# EAGLE design debouncer (EAGLE 9.4.2)
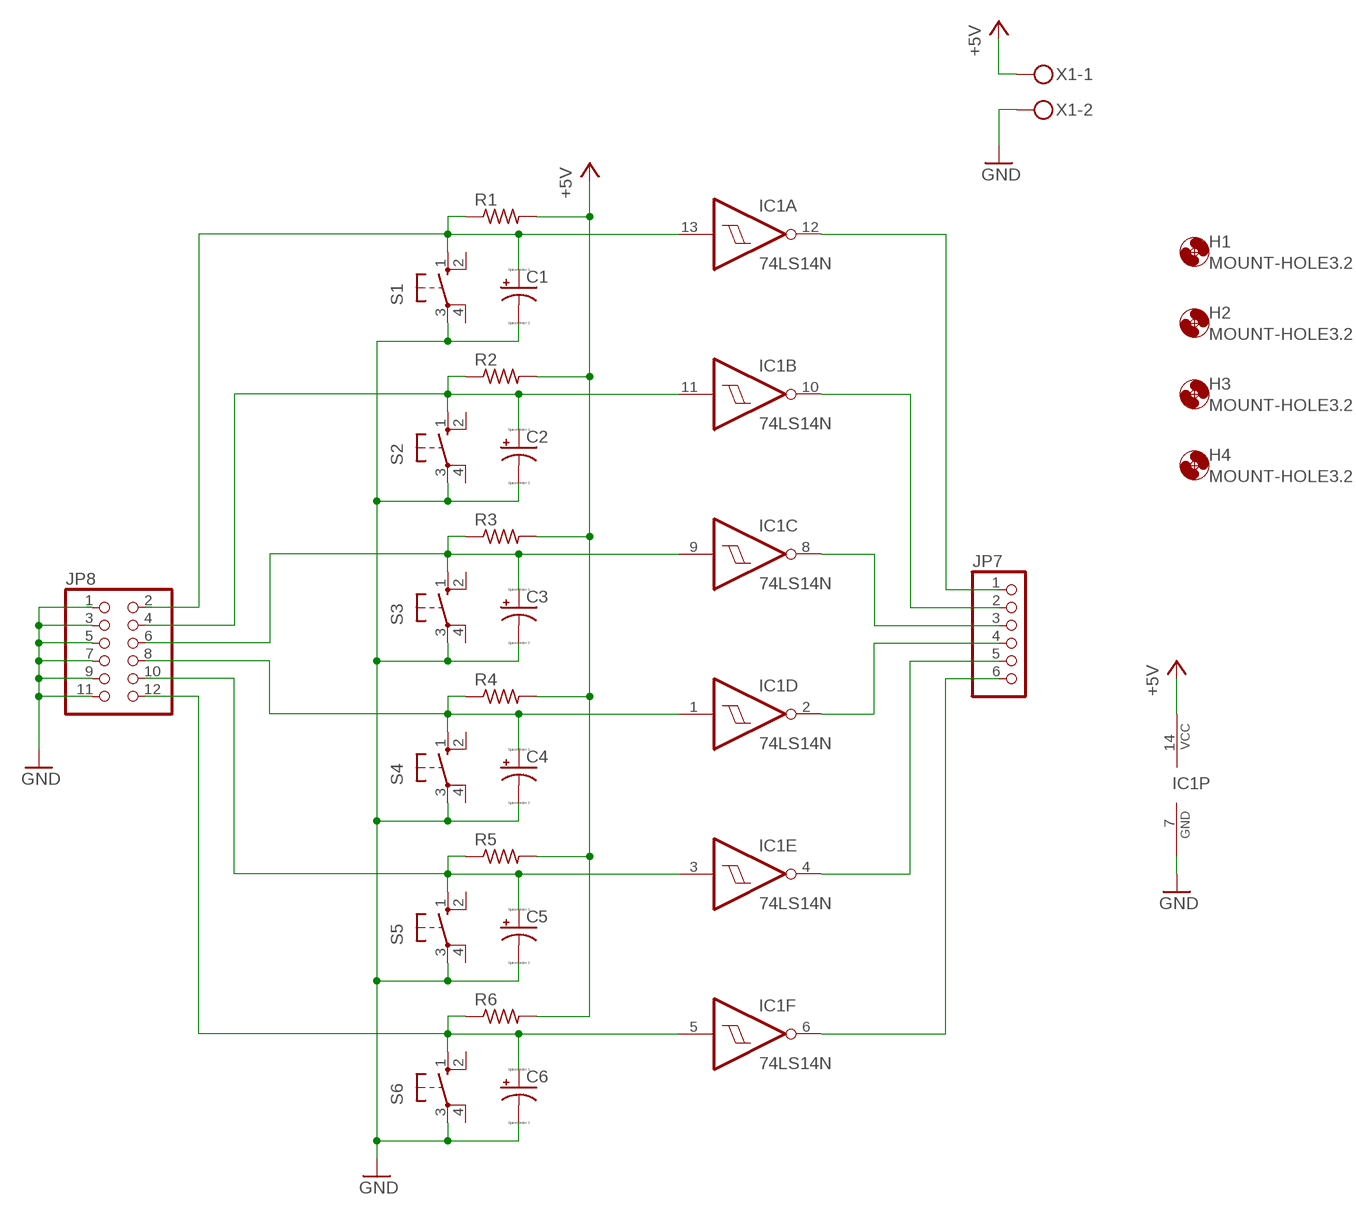
[diagram p0: schematic, sheet 1]

## Parts
C1  CPOL-USE2-5  [E2-5]
C2  CPOL-USE2-5  [E2-5]
C3  CPOL-USE2-5  [E2-5]
C4  CPOL-USE2-5  [E2-5]
C5  CPOL-USE2-5  [E2-5]
C6  CPOL-USE2-5  [E2-5]
H1  MOUNT-HOLE3.2  [3,2]
H2  MOUNT-HOLE3.2  [3,2]
H3  MOUNT-HOLE3.2  [3,2]
H4  MOUNT-HOLE3.2  [3,2]
IC1  74LS14N  [DIL14]
JP7  PINHD-1X6  [1X06]
JP8  PINHD-2X6  [2X06]
R1  R-US_0207/12  [0207/12]
R2  R-US_0207/12  [0207/12]
R3  R-US_0207/12  [0207/12]
R4  R-US_0207/12  [0207/12]
R5  R-US_0207/12  [0207/12]
R6  R-US_0207/12  [0207/12]
S1  10-XX  [B3F-10XX]
S2  10-XX  [B3F-10XX]
S3  10-XX  [B3F-10XX]
S4  10-XX  [B3F-10XX]
S5  10-XX  [B3F-10XX]
S6  10-XX  [B3F-10XX]
X1  MKDSN1,5/2-5,08  [MKDSN1,5/2-5,08]

## Nets
+5V: IC1.14(P:VCC) R1.2 R2.2 R3.2 R4.2 R5.2 R6.2 X1.1
GND: C1.- C2.- C3.- C4.- C5.- C6.- IC1.7(P:GND) JP8.1 JP8.3 JP8.5 JP8.7 JP8.9 JP8.11 S1.3(P) S2.3(P) S3.3(P) S4.3(P) S5.3(P) S6.3(P) X1.2
N$1: C1.+ IC1.13(A:I) JP8.2 R1.1 S1.1(S)
N$2: IC1.6(F:O) JP7.6
N$3: IC1.4(E:O) JP7.5
N$4: IC1.2(D:O) JP7.4
N$5: C2.+ IC1.11(B:I) JP8.4 R2.1 S2.1(S)
N$6: IC1.8(C:O) JP7.3
N$7: IC1.10(B:O) JP7.2
N$8: C3.+ IC1.9(C:I) JP8.6 R3.1 S3.1(S)
N$9: IC1.12(A:O) JP7.1
N$11: C4.+ IC1.1(D:I) JP8.8 R4.1 S4.1(S)
N$14: C5.+ IC1.3(E:I) JP8.10 R5.1 S5.1(S)
N$17: C6.+ IC1.5(F:I) JP8.12 R6.1 S6.1(S)
Unconnected: S1.2(S1) S1.4(P1) S2.2(S1) S2.4(P1) S3.2(S1) S3.4(P1) S4.2(S1) S4.4(P1) S5.2(S1) S5.4(P1) S6.2(S1) S6.4(P1)

## Library data of the parts
C1-C6 = resistor:CPOL-US: POLARIZED CAPACITOR, American symbol
H1-H4 = holes:MOUNT-HOLE: MOUNTING HOLE with drill center marker
IC1 = 74xx-us:74*14: Hex schmitt trigger INVERTER
JP7 = pinhead:PINHD-1X6: PIN HEADER
JP8 = pinhead:PINHD-2X6: PIN HEADER
R1-R6 = resistor:R-US_: RESISTOR, American symbol
S1-S6 = switch-omron:10-XX: OMRON SWITCH; MPN: B3F-1000; OC_FARNELL: 176432; OC_NEWARK: 36M3542
X1 = con-phoenix-508:MKDSN1,5/2-5,08: MKDSN 1,5/ 2-5,08 Printklemme Nennstrom: 13,5 A Nennspannung: 250 V Rastermaß: 5,08 mm Polzahl: 2 Anschlussart: Schraubanschluss Montage: Löten Anschlussrichtung Leiter/Platine: 0 ° Artikelnummer: 1729128 Source: http://eshop.phoenixcontact.com .. 1729128.pdf

## Board
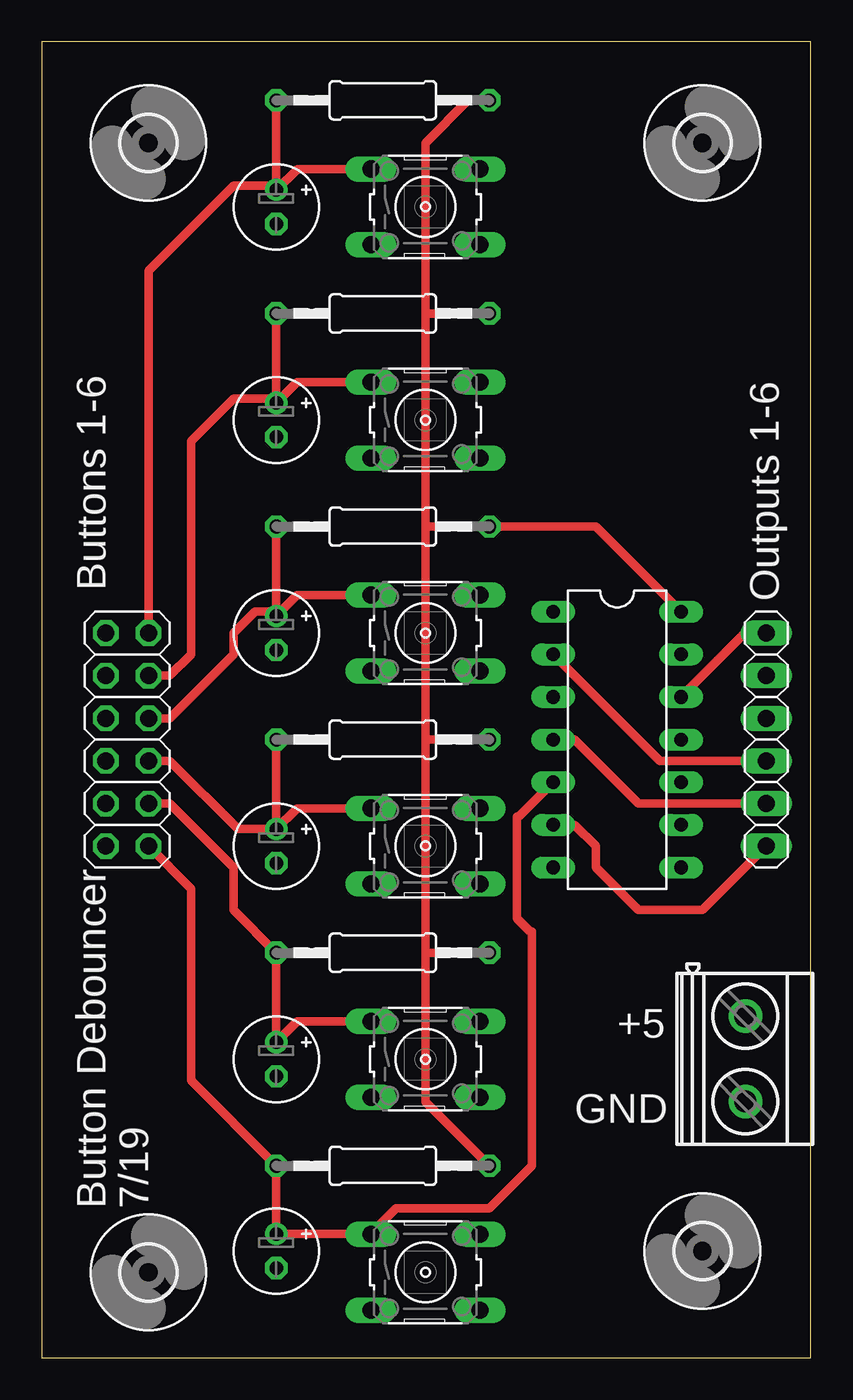
[diagram p1: board, top side]
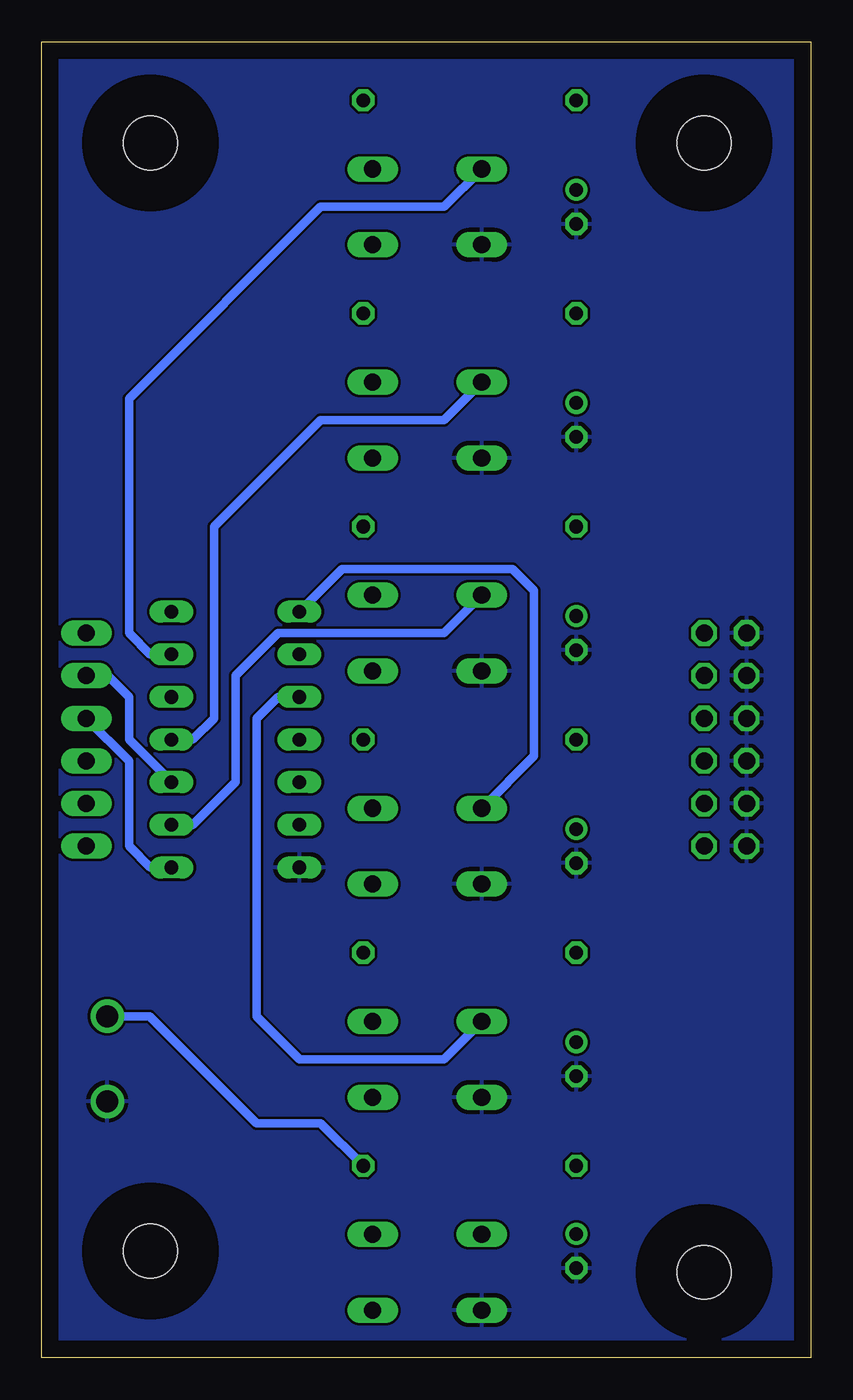
[diagram p2: board, bottom side, seen from below]

Size 45.83 x 78.41 mm. Coordinates in mm from the lower left corner, seen from the top.
Outline: 0,0 45.83,0 45.83,78.41 0,78.41 0,0
Copper layers (1*16): Top 0.035mm / dielectric 1.5mm / Bottom 0.035mm
Design rules "default": minimum track width 6mil, minimum drill 0.35mm, track to track 6mil, track to pad 6mil, pad to pad 6mil, via to via 6mil, smd to smd 6mil, copper to edge 40mil, drill to drill 6mil, minimum pad ring 10mil, minimum via ring 8mil, stop-mask expansion 4mil, vias tented up to drill 0mil, thermal gap 10mil

### Footprints (pad centres in the part's own frame; a part is rotated, then mirrored left to right if it is on the bottom)
E2-5 = drill 0.813 pad 1.27: + -1.016,0 | drill 0.813 pad 1.27 octagon: - 1.016,0
3,2 = hole 3.2: 0,0
DIL14 = drill 0.813 long: 1 -7.62,-3.81; 2 -5.08,-3.81; 3 -2.54,-3.81; 4 0,-3.81; 5 2.54,-3.81; 6 5.08,-3.81; 7 7.62,-3.81; 8 7.62,3.81; 9 5.08,3.81; 10 2.54,3.81; 11 0,3.81; 12 -2.54,3.81; 13 -5.08,3.81; 14 -7.62,3.81
1X06 = drill 1.016 long: 1 -6.35,0; 2 -3.81,0; 3 -1.27,0; 4 1.27,0; 5 3.81,0; 6 6.35,0
2X06 = drill 1.016 octagon: 1 -6.35,-1.27; 2 -6.35,1.27; 3 -3.81,-1.27; 4 -3.81,1.27; 5 -1.27,-1.27; 6 -1.27,1.27; 7 1.27,-1.27; 8 1.27,1.27; 9 3.81,-1.27; 10 3.81,1.27; 11 6.35,-1.27; 12 6.35,1.27
0207/12 = drill 0.813 octagon: 1 -6.35,0; 2 6.35,0
B3F-10XX = drill 1.016 long: 1 -3.251,2.261; 2 3.251,2.261; 3 -3.251,-2.261; 4 3.251,-2.261
MKDSN1,5/2-5,08 = drill 1.3 pad 2: 1 -2.561,0.025; 2 2.519,0.025

### Placement (x,y rotation side)
C1  13.97,68.58 270 top
C2  13.97,55.88 270 top
C3  13.97,43.18 270 top
C4  13.97,30.48 270 top
C5  13.97,17.78 270 top
C6  13.97,6.35 270 top
H1  6.35,72.39 0 top
H2  39.37,72.39 0 top
H3  6.35,5.08 0 top
H4  39.37,6.35 0 top
IC1  34.29,36.83 270 top
JP7  43.18,36.83 270 top
JP8  5.08,36.83 270 top
R1  20.32,74.93 0 top
R2  20.32,62.23 0 top
R3  20.32,49.53 0 top
R4  20.32,36.83 0 top
R5  20.32,24.13 0 top
R6  20.32,11.43 0 top
S1  22.86,68.58 0 top
S2  22.86,55.88 0 top
S3  22.86,43.18 0 top
S4  22.86,30.48 0 top
S5  22.86,17.78 0 top
S6  22.86,5.08 0 top
X1  41.91,17.78 270 top

### Tracks (layer width: path | path; a pad name or v marks a point on that pad's centre or on a via)
+5V
  Top 0.508: R6.2 22.86,15.24 22.86,24.13 | R1.2 25.4,74.93 22.86,72.39 22.86,62.23 | 22.86,24.13 22.86,36.83 | 22.86,36.83 22.86,49.53 | 22.86,49.53 22.86,62.23 | R2.2 22.86,62.23 | 22.86,49.53 R3.2 33.02,49.53 IC1.14 | R4.2 22.86,36.83 | R5.2 22.86,24.13
  Bottom 0.508: R6.2 29.21,13.97 33.02,13.97 39.39,20.34 X1.1
GND
  pour Bottom: -2.54,-1.27 -2.54,80.01 48.26,80.01 48.26,-1.27
N$1
  Top 0.508: JP8.2 6.35,64.77 11.43,69.85 13.72,69.85 C1.+ | R1.1 C1.+ | S1.1 15.24,70.84 13.99,69.6 C1.+
  Bottom 0.508: S1.1 21.87,68.58 29.21,68.58 40.64,57.15 40.64,43.18 39.37,41.91 IC1.13
N$2
  Top 0.508: IC1.6 31.75,31.75 33.02,30.48 33.02,29.21 35.56,26.67 39.37,26.67 JP7.6
N$3
  Top 0.508: IC1.4 31.75,36.83 35.56,33.02 JP7.5
N$4
  Top 0.508: IC1.2 36.83,35.56 JP7.4
N$5
  Top 0.508: JP8.4 7.62,40.64 8.89,41.91 8.89,54.61 11.43,57.15 13.72,57.15 C2.+ | R2.1 C2.+ | C2.+ 15.21,58.14 S2.1
  Bottom 0.508: S2.1 21.87,55.88 29.21,55.88 35.56,49.53 35.56,38.1 36.83,36.83 IC1.11
N$6
  Bottom 0.508: IC1.8 39.37,29.21 40.64,30.48 40.64,35.56 JP7.3
N$7
  Bottom 0.508: IC1.10 40.64,36.83 40.64,39.37 41.91,40.64 JP7.2
N$8
  Top 0.508: JP8.6 7.62,38.1 11.43,41.91 11.43,43.18 12.7,44.45 13.72,44.45 C3.+ | R3.1 C3.+ | C3.+ 15.21,45.44 S3.1
  Bottom 0.508: S3.1 21.87,43.18 31.75,43.18 34.29,40.64 34.29,34.29 36.83,31.75 IC1.9
N$9
  Top 0.508: IC1.12 41.91,43.18 JP7.1
N$11
  Top 0.508: JP8.8 7.62,35.56 11.68,31.5 C4.+ | C4.+ R4.1 | C4.+ 15.21,32.74 S4.1
  Bottom 0.508: S4.1 16.51,35.84 16.51,45.72 17.78,46.99 27.94,46.99 IC1.1
N$14
  Top 0.508: JP8.10 7.62,33.02 11.43,29.21 11.43,26.67 R5.1 C5.+ 15.21,20.04 S5.1
  Bottom 0.508: S5.1 21.87,17.78 30.48,17.78 33.02,20.32 33.02,38.1 31.75,39.37 IC1.3
N$17
  Top 0.508: JP8.12 8.89,27.94 8.89,16.51 R6.1 C6.+ 19.58,7.37 | 19.58,7.37 S6.1 | IC1.5 28.45,32.26 28.32,32.26 28.32,26.16 29.08,25.4 29.21,25.4 29.21,11.43 26.67,8.89 21.11,8.89 19.58,7.37

### Text on the board
tNames: Buttons 1-6 | Outputs 1-6 | +5 | GND | Button Debouncer | 7/19